# EAGLE schematic MesschieberV3 (EAGLE 6.4)

## Sheet 1 of 4
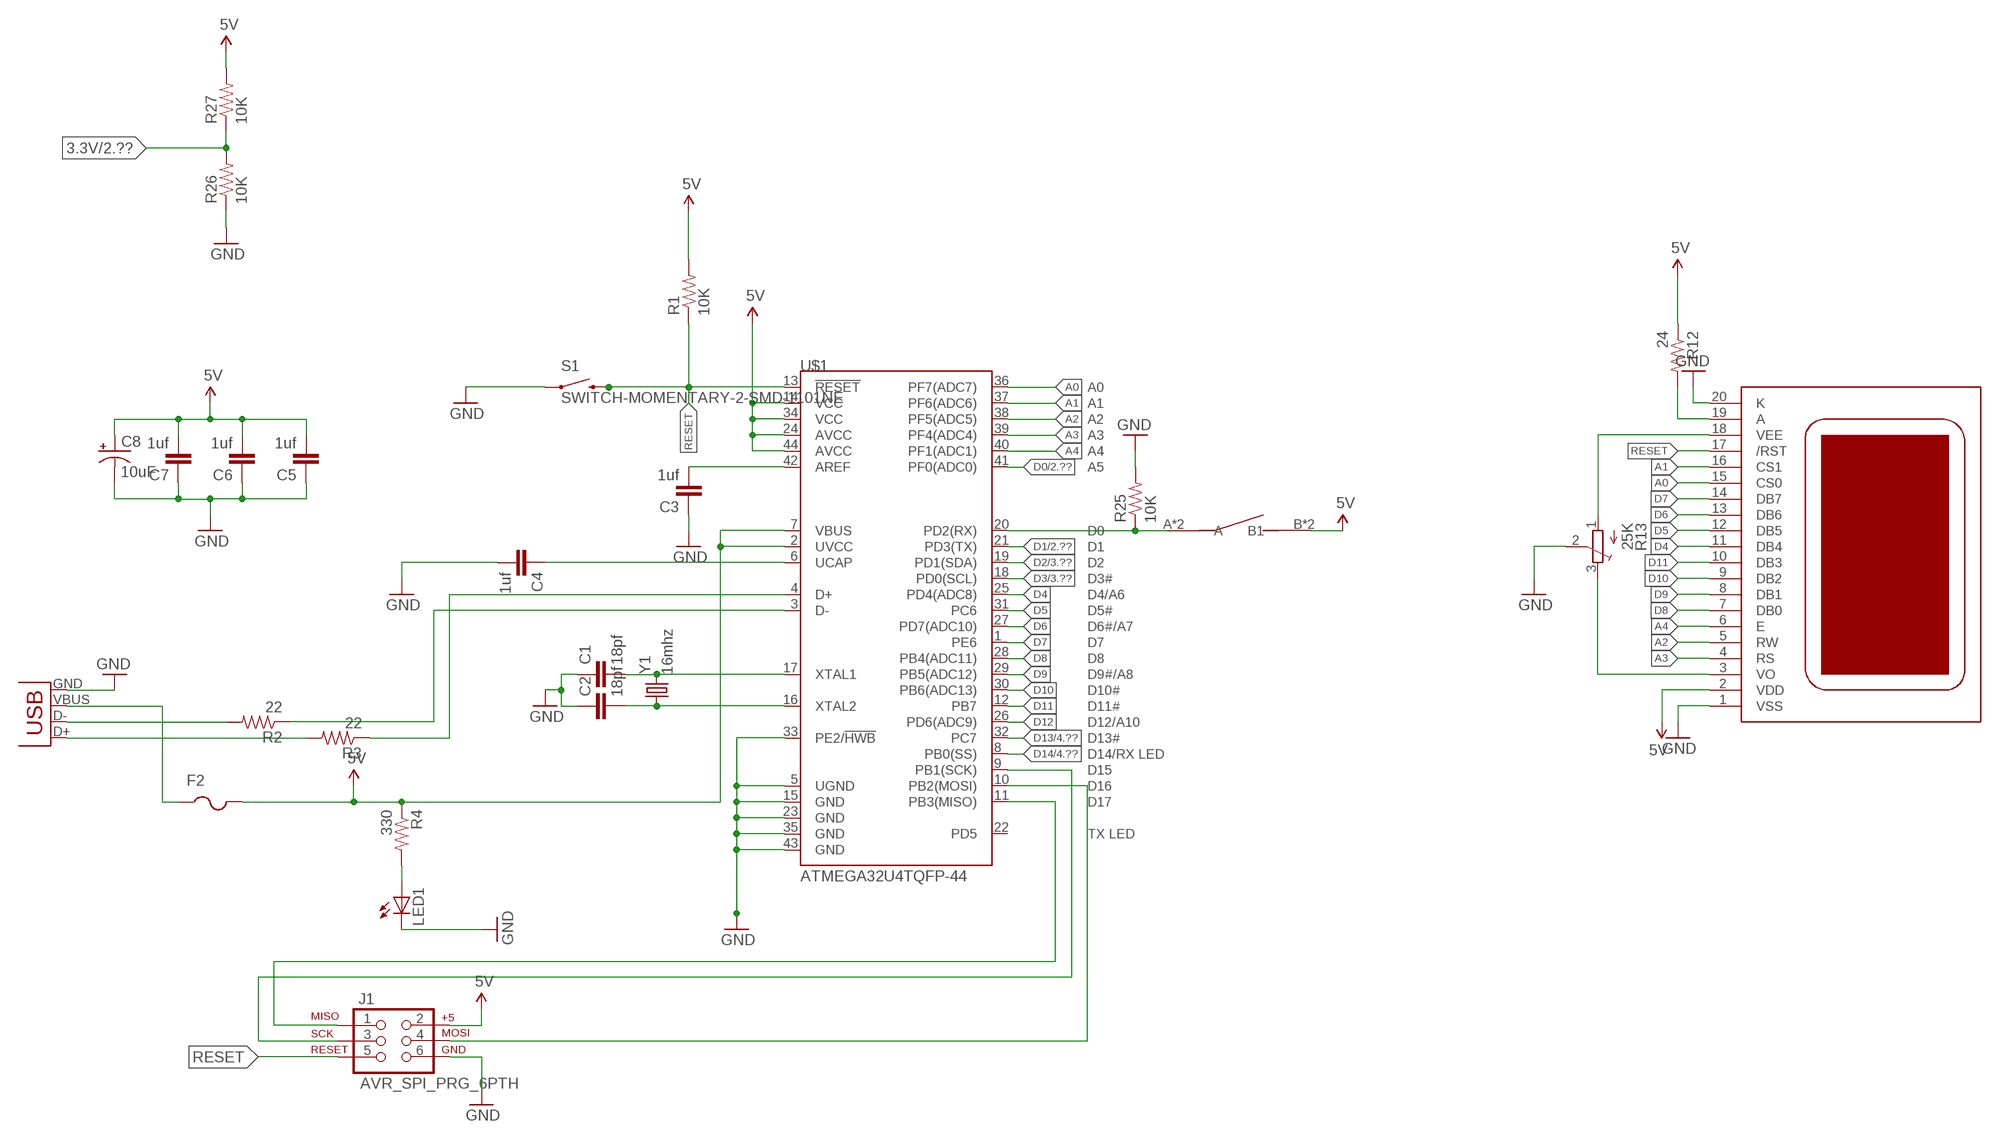
[diagram p0: schematic, sheet 1]

### Parts
C1  18pf  CAP0805  [0805]
C2  18pf  CAP0805  [0805]
C3  1uf  CAP0805  [0805]
C4  1uf  CAP0805  [0805]
C5  1uf  CAP0805  [0805]
C6  1uf  CAP0805  [0805]
C7  1uf  CAP0805  [0805]
C8  10uF  10UF-20V-10%(TANT)  [EIA3528]
F2  PTCFUSE-1812  [1812]
J1  AVR_SPI_PRG_6PTH  [2X3]
JP7  USB-SMD-NS  [USB-MINIB-NOSTOP]
LED1  LEDSML0805  [SML0805]
R1  10K  RESISTOR  [0805]
R2  22  RESISTOR  [0805]
R3  22  RESISTOR  [0805]
R4  330  RESISTOR  [0805]
R12  24  RESISTOR  [0805]
R13  25K  TRIM_EU-SM-42/43A  [SM-42/43A]
R25  10K  RESISTOR  [0805]
R26  10K  RESISTOR  [0805]
R27  10K  RESISTOR  [0805]
S1  SWITCH-MOMENTARY-2-SMD-1101NE  [TACTILE-SWITCH-1101NE]
U$1  ATMEGA32U4TQFP-44  [TQFP44]
U$2  TS12864A  [TS12864]
U$12  TASTE_R3FTL6  [TASTE_R3FTL6]
Y1  16mhz  CRYSTAL5X3  [CRYSTAL-SMD-5X3]

### Nets
3.3V: R26.2 R27.1 ; also sheet 2,3,4
5V: C5.2 C6.2 C7.2 C8.A(+) F2.2 J1.2 R1.2 R4.1 R12.1 R27.2 U$1.2(UVCC) U$1.7(VBUS) U$1.14(VCC) U$1.24(AVCC) U$1.34(VCC) U$1.44(AVCC) U$2.2(VDD) U$12.B1 U$12.B(B1) ; also sheet 2,3,4
A: R12.2 U$2.19(A)
A0: U$1.36(PF7(ADC7)) U$2.15(CS0)
A1: U$1.37(PF6(ADC6)) U$2.16(CS1)
A2: U$1.38(PF5(ADC5)) U$2.5(RW)
A3: U$1.39(PF4(ADC4)) U$2.4(RS)
A4: U$1.40(PF1(ADC1)) U$2.6(E)
D0: U$1.41(PF0(ADC0)) ; also sheet 2
D1: U$1.21(PD3(TX)) ; also sheet 2
D2: U$1.19(PD1(SDA)) ; also sheet 3
D3: U$1.18(PD0(SCL)) ; also sheet 3
D4: U$1.25(PD4(ADC8)) U$2.11(DB4)
D5: U$1.31(PC6) U$2.12(DB5)
D6: U$1.27(PD7(ADC10)) U$2.13(DB6)
D7: U$1.1(PE6) U$2.14(DB7)
D8: U$1.28(PB4(ADC11)) U$2.7(DB0)
D9: U$1.29(PB5(ADC12)) U$2.8(DB1)
D10: U$1.30(PB6(ADC13)) U$2.9(DB2)
D11: U$1.12(PB7) U$2.10(DB3)
D12: U$1.26(PD6(ADC9))
D13: U$1.32(PC7) ; also sheet 4
D14: U$1.8(PB0(SS)) ; also sheet 4
GND: C1.1 C2.1 C3.1 C4.2 C5.1 C6.1 C7.1 C8.C(-) J1.6 JP7.GND LED1.C R13.2(S) R25.2 R26.1 S1.P$1 U$1.5(UGND) U$1.15(GND) U$1.23(GND) U$1.33(PE2/!HWB) U$1.35(GND) U$1.43(GND) U$2.1(VSS) U$2.20(K) ; also sheet 2,3,4
N$1: C3.2 U$1.42(AREF)
N$2: C2.2 U$1.16(XTAL2) Y1.1
N$3: C1.2 U$1.17(XTAL1) Y1.3
N$5: JP7.D- R2.2
N$6: JP7.D+ R3.2
N$7: R3.1 U$1.4(D+)
N$8: R2.1 U$1.3(D-)
N$9: F2.1 JP7.VBUS
N$10: LED1.A R4.2
N$11: J1.3 U$1.9(PB1(SCK))
N$12: J1.1 U$1.11(PB3(MISO))
N$13: J1.4 U$1.10(PB2(MOSI))
N$14: C4.1 U$1.6(UCAP)
N$29: R25.1 U$1.20(PD2(RX)) U$12.A U$12.A1(A)
N$38: R13.3(E) U$2.3(VO)
RESET: J1.5 R1.1 S1.P$2 U$1.13(!RESET) U$2.17(/RST)
VEE: R13.1(A) U$2.18(VEE)
Unconnected: U$1.22(PD5)

## Sheet 2 of 4
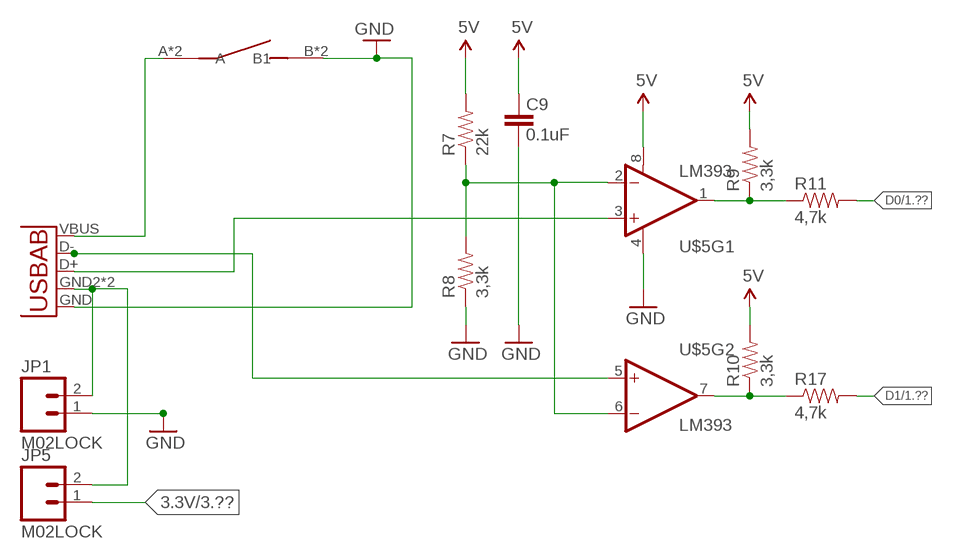
[diagram p1: schematic, sheet 2]

### Parts
C9  0.1uF  CAP0805  [0805]
JP1  M02LOCK  [1X02_LOCK]
JP5  M02LOCK  [1X02_LOCK]
R7  22k  RESISTOR  [0805]
R8  3,3k  RESISTOR  [0805]
R9  3,3k  RESISTOR  [0805]
R10  3,3k  RESISTOR  [0805]
R11  4,7k  RESISTOR  [0805]
R17  4,7k  RESISTOR  [0805]
U$3  TASTE_R3FTL6  [TASTE_R3FTL6]
U$5  LM393  [SO08]
U$7  USB-A  [USB-A]

### Nets
3.3V: JP5.1 ; also sheet 1,3,4
5V: C9.2 R7.2 R9.2 R10.2 U$5.8(V+) ; also sheet 1,3,4
D0: R11.2 ; also sheet 1
D1: R17.2 ; also sheet 1
DATA1: R9.1 R11.1 U$5.1(OUT)
GND: C9.1 JP1.1 R8.1 U$3.B1 U$3.B(B1) U$5.4(V-) U$7.GND ; also sheet 1,3,4
N$4: R7.1 R8.2 U$5.2(-IN) U$5.6(-IN)
N$15: U$5.3(+IN) U$7.D+
N$16: U$5.5(+IN) U$7.D-
N$17: U$3.A U$3.A1(A) U$7.VBUS
N$18: JP1.2 JP5.2 U$7.GND2(USBID) U$7.GND3(USBID)
SCK1: R10.1 R17.1 U$5.7(OUT)

## Sheet 3 of 4
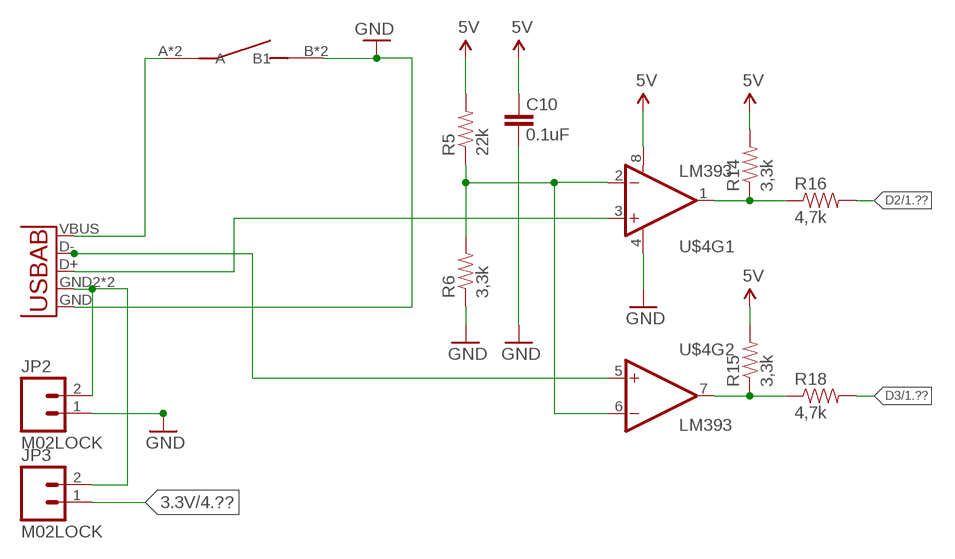
[diagram p2: schematic, sheet 3]

### Parts
C10  0.1uF  CAP0805  [0805]
JP2  M02LOCK  [1X02_LOCK]
JP3  M02LOCK  [1X02_LOCK]
R5  22k  RESISTOR  [0805]
R6  3,3k  RESISTOR  [0805]
R14  3,3k  RESISTOR  [0805]
R15  3,3k  RESISTOR  [0805]
R16  4,7k  RESISTOR  [0805]
R18  4,7k  RESISTOR  [0805]
U$4  LM393  [SO08]
U$6  USB-A  [USB-A]
U$8  TASTE_R3FTL6  [TASTE_R3FTL6]

### Nets
3.3V: JP3.1 ; also sheet 1,2,4
5V: C10.2 R5.2 R14.2 R15.2 U$4.8(V+) ; also sheet 1,2,4
D2: R16.2 ; also sheet 1
D3: R18.2 ; also sheet 1
DATA2: R14.1 R16.1 U$4.1(OUT)
GND: C10.1 JP2.1 R6.1 U$4.4(V-) U$6.GND U$8.B1 U$8.B(B1) ; also sheet 1,2,4
N$19: R5.1 R6.2 U$4.2(-IN) U$4.6(-IN)
N$20: U$4.3(+IN) U$6.D+
N$21: U$4.5(+IN) U$6.D-
N$22: U$6.VBUS U$8.A U$8.A1(A)
N$23: JP2.2 JP3.2 U$6.GND2(USBID) U$6.GND3(USBID)
SCK2: R15.1 R18.1 U$4.7(OUT)

## Sheet 4 of 4
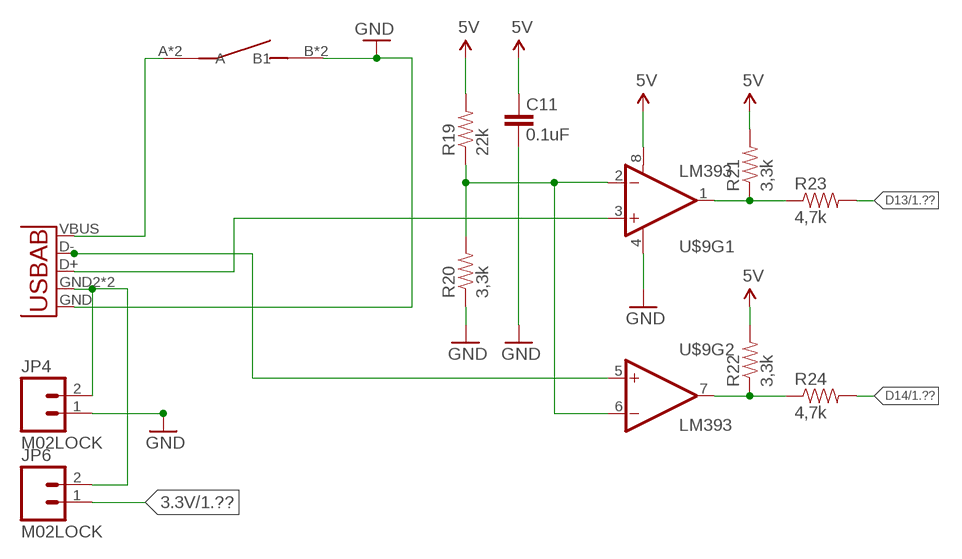
[diagram p3: schematic, sheet 4]

### Parts
C11  0.1uF  CAP0805  [0805]
JP4  M02LOCK  [1X02_LOCK]
JP6  M02LOCK  [1X02_LOCK]
R19  22k  RESISTOR  [0805]
R20  3,3k  RESISTOR  [0805]
R21  3,3k  RESISTOR  [0805]
R22  3,3k  RESISTOR  [0805]
R23  4,7k  RESISTOR  [0805]
R24  4,7k  RESISTOR  [0805]
U$9  LM393  [SO08]
U$10  USB-A  [USB-A]
U$11  TASTE_R3FTL6  [TASTE_R3FTL6]

### Nets
3.3V: JP6.1 ; also sheet 1,2,3
5V: C11.2 R19.2 R21.2 R22.2 U$9.8(V+) ; also sheet 1,2,3
D13: R23.2 ; also sheet 1
D14: R24.2 ; also sheet 1
DATA3: R21.1 R23.1 U$9.1(OUT)
GND: C11.1 JP4.1 R20.1 U$9.4(V-) U$10.GND U$11.B1 U$11.B(B1) ; also sheet 1,2,3
N$24: R19.1 R20.2 U$9.2(-IN) U$9.6(-IN)
N$25: U$9.3(+IN) U$10.D+
N$26: U$9.5(+IN) U$10.D-
N$27: U$10.VBUS U$11.A U$11.A1(A)
N$28: JP4.2 JP6.2 U$10.GND2(USBID) U$10.GND3(USBID)
SCK3: R22.1 R24.1 U$9.7(OUT)

## Library data of the parts
C1-C7 = SparkFun-Capacitors:CAP: Capacitor Standard 0603 ceramic capacitor, and 0.1" leaded capacitor.
C8 = SparkFun-Capacitors:10UF-20V-10%(TANT): CAP-08063; PROD_ID: CAP-08063
C9-C11 = SparkFun:CAP: Capacitor Standard 0603 ceramic capacitor, and 0.1" leaded capacitor.
F2 = adafruit:PTCFUSE: PTC fuses, resettable thermistors
J1 = SparkFun-Connectors:AVR_SPI_PRG_6: AVR ISP 6 Pin This is the reduced ISP connector for AVR programming. Common on Arduino. This footprint will take up less PCB space and can be used with a 10-pin to 6-pin adapter such as SKU: BOB-08508
JP1-JP6 = SparkFun-Connectors:M02: Standard 2-pin 0.1" header. Use with - straight break away headers ( PRT-00116) - right angle break away headers (PRT-00553) - swiss pins (PRT-00743) - machine pins (PRT-00117) - female headers (PRT-00115) Molex polarized connector foot print use with: PRT-08233 with associated crimp pins and housings. 2.54_SCREWTERM for use with PRT-10571. 3.5mm Screw Terminal footprints for PRT-08084 5mm Screw Terminal footprints for use with PRT-08433
JP7 = SparkFun-Connectors:USB: USB Connectors USB-B-PTH is fully proven SKU : PRT-00139/CONN-08278 USB-miniB is fully proven SKU : PRT-00587 USB-A-PCB is untested. USB-A-H is throughly reviewed, but untested. Spark Fun Electronics SKU : PRT-00437 USB-B-SMT is throughly reviewed, but untested. Needs silkscreen touching up. USB-A-S has not been used/tested USB-MB-H has not been used/tested USB-MICROB has been used. CONN-09505
LED1 = led:LED: LED OSRAM: - CHIPLED LG R971, LG N971, LY N971, LG Q971, LY Q971, LO R971, LY R971 LH N974, LH R974 LS Q976, LO Q976, LY Q976 LO Q996 - Hyper CHIPLED LW Q18S LB Q993, LB Q99A, LB R99A - SideLED LS A670, LO A670, LY A670, LG A670, LP A670 LB A673, LV A673, LT A673, LW A673 LH A674 LY A675 LS A676, LA A676, LO A676, LY A676, LW A676 LS A679, LY A679, LG A679 - Hyper Micro SIDELED® LS Y876, LA Y876, LO Y876, LY Y876 LT Y87S - SmartLED LW L88C, LW L88S LB L89C, LB L89S, LG L890 LS L89K, LO L89K, LY L89K LS L896, LA L896, LO L896, LY L896 - TOPLED LS T670, LO T670, LY T670, LG T670, LP T670 LSG T670, LSP T670, LSY T670, LOP T670, LYG T670 LG T671, LOG T671, LSG T671 LB T673, LV T673, LT T673, LW T673 LH T674 LS T676, LA T676, LO T676, LY T676, LB T676, LH T676, LSB T676, LW T676 LB T67C, LV T67C, LT T67C, LS T67K, LO T67K, LY T67K, LW E67C LS E67B, LA E67B, LO E67B, LY E67B, LB E67C, LV E67C, LT E67C LW T67C LS T679, LY T679, LG T679 LS T770, LO T770, LY T770, LG T770, LP T770 LB T773, LV T773, LT T773, LW T773 LH T774 LS E675, LA E675, LY E675, LS T675 LS T776, LA T776, LO T776, LY T776, LB T776 LHGB T686 LT T68C, LB T68C - Hyper Mini TOPLED® LB M676 - Mini TOPLED Santana® LG M470 LS M47K, LO M47K, LY M47K Source: http://www.osram.convergy.de LUXEON: - LUMILED® LXK2-PW12-R00, LXK2-PW12-S00, LXK2-PW14-U00, LXK2-PW14-V00 LXK2-PM12-R00, LXK2-PM12-S00, LXK2-PM14-U00 LXK2-PE12-Q00, LXK2-PE12-R00, LXK2-PE12-S00, LXK2-PE14-T00, LXK2-PE14-U00 LXK2-PB12-K00, LXK2-PB12-L00, LXK2-PB12-M00, LXK2-PB14-N00, LXK2-PB14-P00, LXK2-PB14-Q00 LXK2-PR12-L00, LXK2-PR12-M00, LXK2-PR14-Q00, LXK2-PR14-R00 LXK2-PD12-Q00, LXK2-PD12-R00, LXK2-PD12-S00 LXK2-PH12-R00, LXK2-PH12-S00 LXK2-PL12-P00, LXK2-PL12-Q00, LXK2-PL12-R00 Source: www.luxeon.com KINGBRIGHT: KA-3528ASYC Source: www.kingbright.com
R1-R12 R14-R27 = SparkFun:RESISTOR: Resistor Basic schematic elements and footprints for 0603, 1206, and PTH 1/10th watt (small) resistors.
R13 = pot:TRIM_EU-: POTENTIOMETER
S1 = SparkFun-Electromechanical:SWITCH-MOMENTARY-2: Various NO switches- pushbuttons, reed, etc
U$1 = SparkFun-DigitalIC:ATMEGA32U4: Atmel 44-pin 8-bit Microcontroller with 32KBytes of ISP Flash and USB Controller
U$2 = adafruit:TS12864A: KS0108 based display. Some have slightly different pinouts so double check!
U$3 U$8 U$11 U$12 = andi:TASTE_R3FTL6: http://www.reichelt.de/Kurzhubtaster/TASTER-3FTL6/3/index.html?&ACTION=3&LA=2&ARTICLE=79697&GROUPID=3278&artnr=TASTER+3FTL6
U$4 U$5 U$9 = SparkFun-AnalogIC:LM393: Low-voltage comparator
U$6 U$7 U$10 = andi:USB-A
Y1 = SparkFun-FreqCtrl:CRYSTAL: Various standard crystals. Proven footprints. Spark Fun Electronics SKU : COM-00534

## Net classes
0 default: width 0.203 mm, clearance 0.205 mm
1 vcc: width 0.254 mm, clearance 0.205 mm to class 0, clearance 0.205 mm